# Altium schematic sheet Schem Motherboard.SchDoc
size A3; SheetNumber: 1; SheetTotal: 3
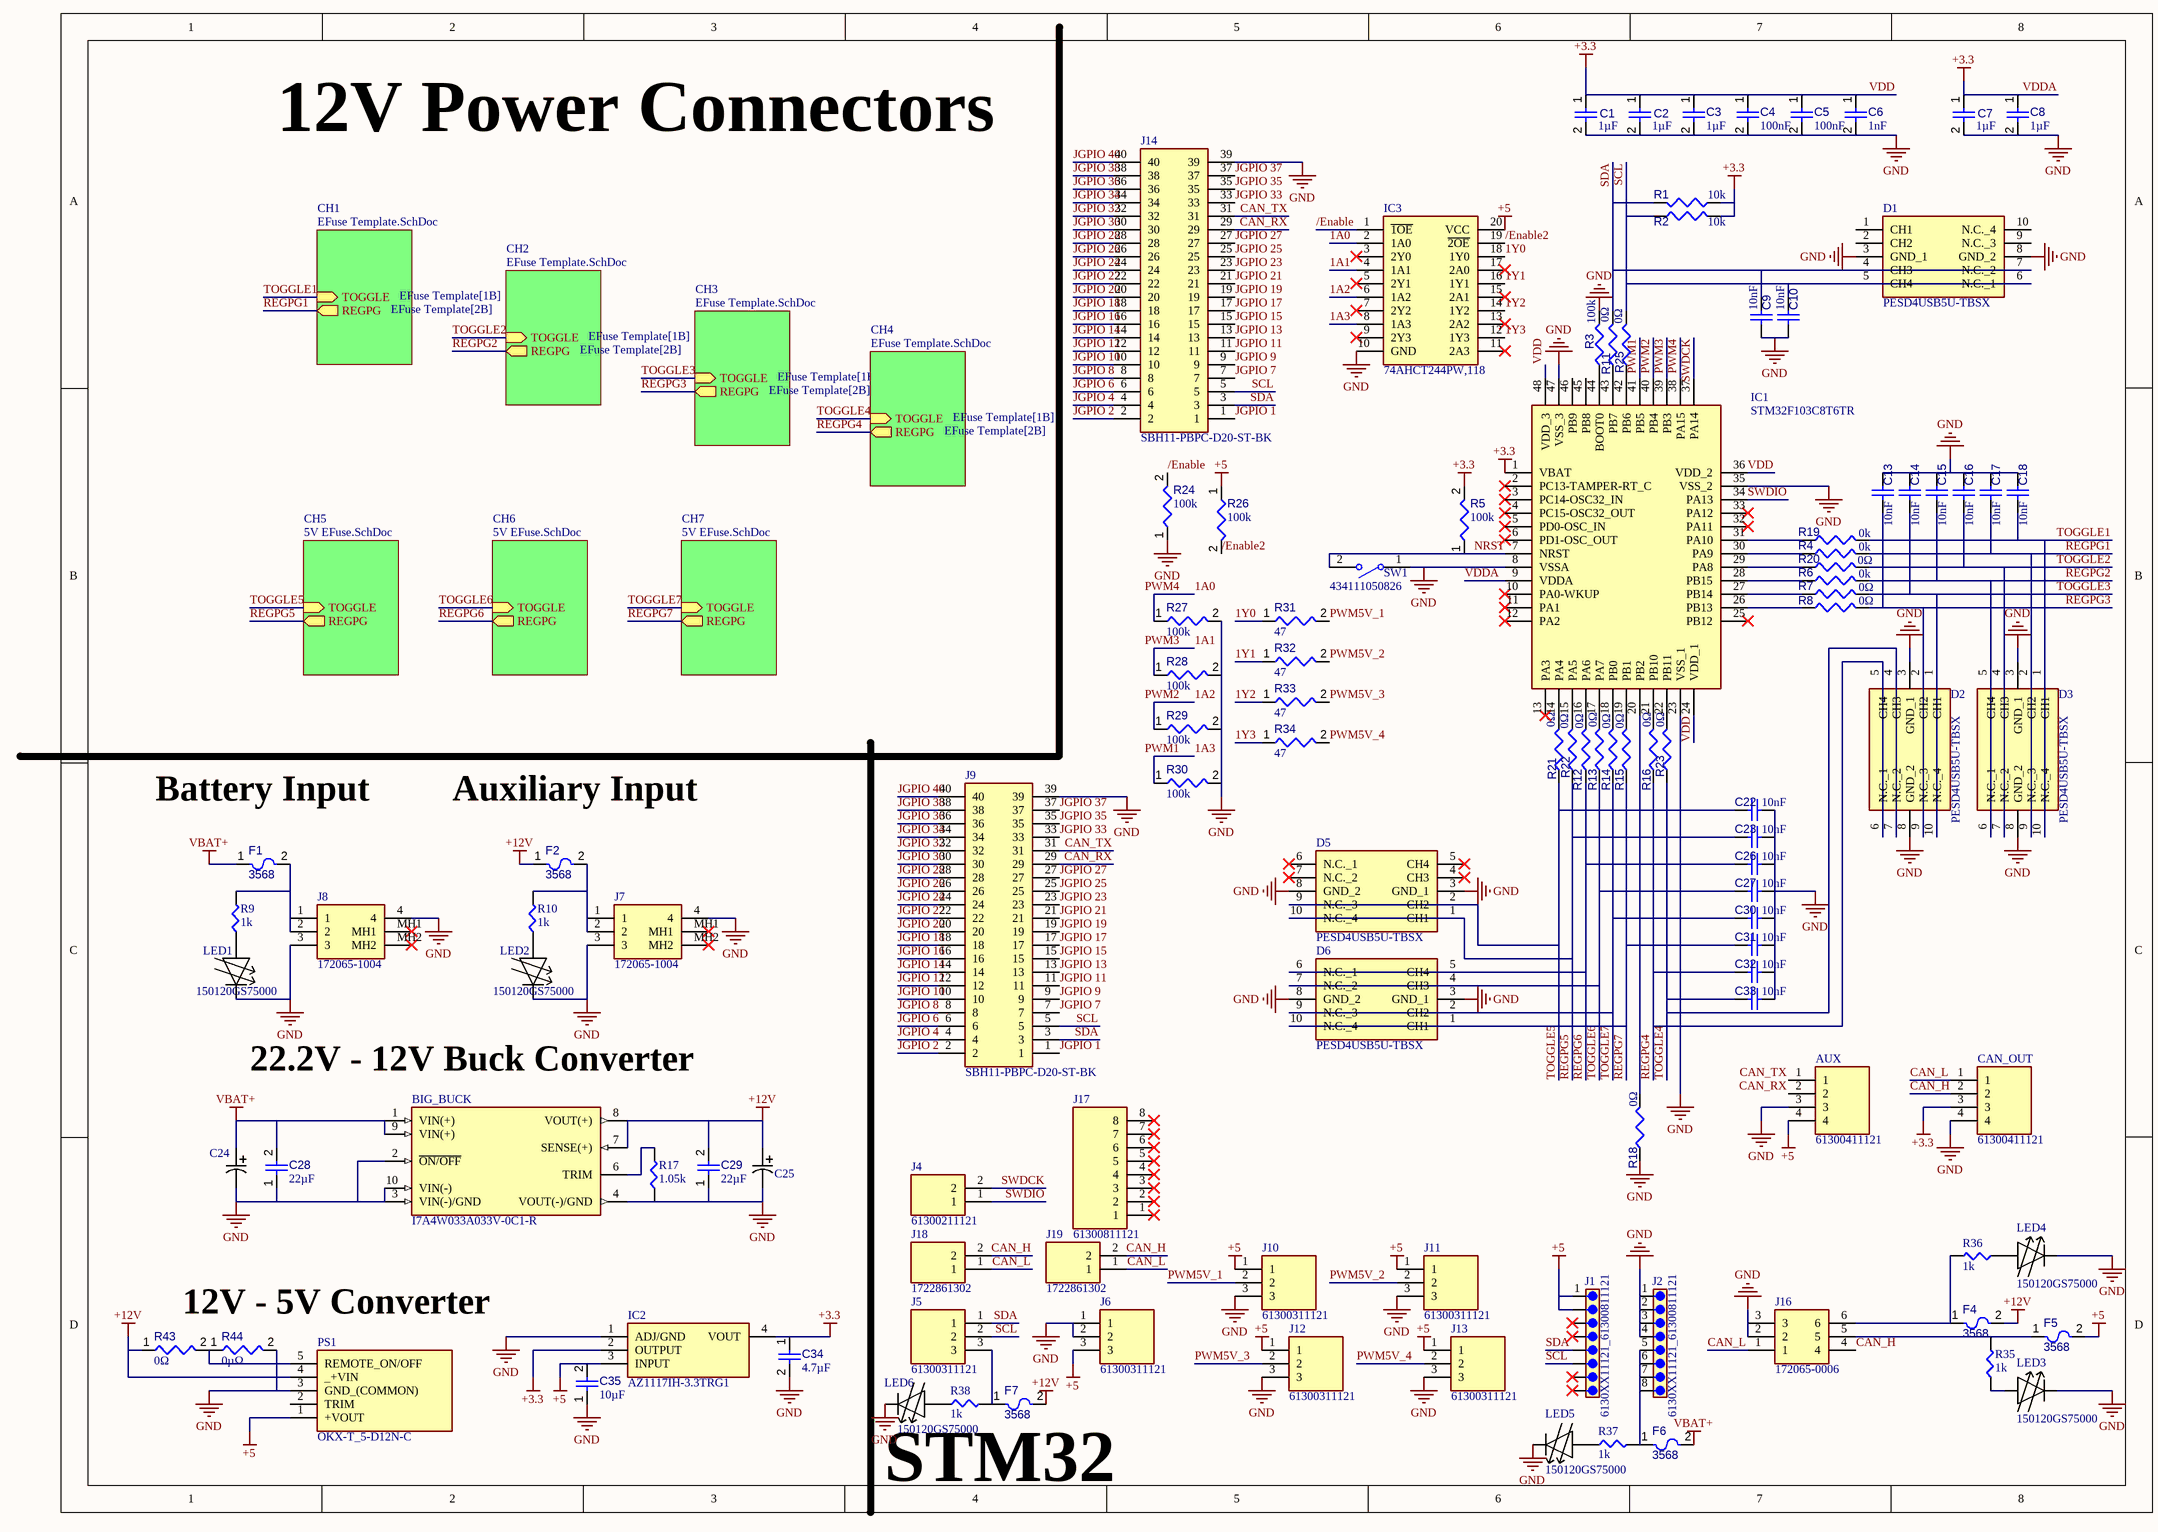
[diagram p0: Schem Motherboard.SchDoc]

## Parts
AUX  61300411121  [HDRV4W95P0X254_1X4_1016X254X854P]
BIG_BUCK  I7A4W033A033V-0C1-R  [CONV_I7A4W033A033V-0C1-R]
C1  value 1µF  [CAPC1608X94X35NL15T15]  (hidden comment: Capacitor 1 uF +/- 10% 16 V 0603)
C2  value 1µF  [CAPC1608X94X35NL15T15]  (hidden comment: Capacitor 1 uF +/- 10% 16 V 0603)
C3  value 1µF  [CAPC1608X94X35NL15T15]  (hidden comment: Capacitor 1 uF +/- 10% 16 V 0603)
C4  value 100nF  [CAPC1608X94X35NL15T15]  (hidden comment: Capacitor 1 uF +/- 10% 16 V 0603)
C5  value 100nF  [CAPC1608X94X35NL15T15]  (hidden comment: Capacitor 1 uF +/- 10% 16 V 0603)
C6  value 1nF  [CAPC1608X94X35NL15T15]  (hidden comment: Capacitor 1 uF +/- 10% 16 V 0603)
C7  value 1µF  [CAPC1608X94X35NL15T15]  (hidden comment: Capacitor 1 uF +/- 10% 16 V 0603)
C8  value 1µF  [CAPC1608X94X35NL15T15]  (hidden comment: Capacitor 1 uF +/- 10% 16 V 0603)
C9  value 10nF  [CAPC0402(1005)60_L]  (hidden comment: Capacitor 10nF +/-20% 50V 0402)
C10  value 10nF  [CAPC0402(1005)60_L]  (hidden comment: Capacitor 10nF +/-20% 50V 0402)
C13  value 10nF  [CAPC0402(1005)60_L]  (hidden comment: Capacitor 10nF +/-20% 50V 0402)
C14  value 10nF  [CAPC0402(1005)60_L]  (hidden comment: Capacitor 10nF +/-20% 50V 0402)
C15  value 10nF  [CAPC0402(1005)60_L]  (hidden comment: Capacitor 10nF +/-20% 50V 0402)
C16  value 10nF  [CAPC0402(1005)60_L]  (hidden comment: Capacitor 10nF +/-20% 50V 0402)
C17  value 10nF  [CAPC0402(1005)60_L]  (hidden comment: Capacitor 10nF +/-20% 50V 0402)
C18  value 10nF  [CAPC0402(1005)60_L]  (hidden comment: Capacitor 10nF +/-20% 50V 0402)
C22  value 10nF  [CAPC0402(1005)60_L]  (hidden comment: Capacitor 10nF +/-20% 50V 0402)
C23  value 10nF  [CAPC0402(1005)60_L]  (hidden comment: Capacitor 10nF +/-20% 50V 0402)
C24  UWT1E331MNL1GS  [PCAP_8x10-ELECT_NCA]  (value not drawn)
C25  UWT1E331MNL1GS  [PCAP_8x10-ELECT_NCA]  (value not drawn)
C26  value 10nF  [CAPC0402(1005)60_L]  (hidden comment: Capacitor 10nF +/-20% 50V 0402)
C27  value 10nF  [CAPC0402(1005)60_L]  (hidden comment: Capacitor 10nF +/-20% 50V 0402)
C28  value 22µF  [FP-GRM32E-0_3-0_2-IPC_C]  (hidden comment: GRM32ER71E226ME15K)
C29  value 22µF  [CAPC0805(2012)145_L]  (hidden comment: Capacitor 22µF +/-40% 16V 0805)
C30  value 10nF  [CAPC0402(1005)60_L]  (hidden comment: Capacitor 10nF +/-20% 50V 0402)
C31  value 10nF  [CAPC0402(1005)60_L]  (hidden comment: Capacitor 10nF +/-20% 50V 0402)
C32  value 10nF  [CAPC0402(1005)60_L]  (hidden comment: Capacitor 10nF +/-20% 50V 0402)
C33  value 10nF  [CAPC0402(1005)60_L]  (hidden comment: Capacitor 10nF +/-20% 50V 0402)
C34  value 4.7µF  [CAPC0805(2012)145_L]  (hidden comment: Capacitor 4.7µF +/-40% 25V 0805)
C35  value 10µF  [CAPC3216X180X50NL20T25]  (hidden comment: Capacitor 10 uF +/- 10% 16 V 1206)
CAN_OUT  61300411121  [HDRV4W95P0X254_1X4_1016X254X854P]
D1  PESD4USB5U-TBSX  [SON50P100X250X80-10N]
D2  PESD4USB5U-TBSX  [SON50P100X250X80-10N]
D3  PESD4USB5U-TBSX  [SON50P100X250X80-10N]
D5  PESD4USB5U-TBSX  [SON50P100X250X80-10N]
D6  PESD4USB5U-TBSX  [SON50P100X250X80-10N]
F1  3568  [KSTN-3568_V]
F2  3568  [KSTN-3568_V]
F4  3568  [KSTN-3568_V]
F5  3568  [KSTN-3568_V]
F6  3568  [KSTN-3568_V]
F7  3568  [KSTN-3568_V]
IC1  STM32F103C8T6TR  [QFP50P900X900X160-48N]
IC2  AZ1117IH-3.3TRG1  [SOT230P700X180-4N]
IC3  74AHCT244PW,118  [SOP65P640X110-20N]
J1  6130XX11121_61300811121  [61300811121]
J2  6130XX11121_61300811121  [61300811121]
J4  61300211121  [HDRV2W110P0X254_1X2_508X254X854P]
J5  61300311121  [HDRV3W64P0X254_1X3_762X254X869P]
J6  61300311121  [HDRV3W64P0X254_1X3_762X254X869P]
J7  172065-1004  [1720651004]
J8  172065-1004  [1720651004]
J9  SBH11-PBPC-D20-ST-BK  [SHDR40W64P254_2X20_5830X910X910P]
J10  61300311121  [HDRV3W64P0X254_1X3_762X254X869P]
J11  61300311121  [HDRV3W64P0X254_1X3_762X254X869P]
J12  61300311121  [HDRV3W64P0X254_1X3_762X254X869P]
J13  61300311121  [HDRV3W64P0X254_1X3_762X254X869P]
J14  SBH11-PBPC-D20-ST-BK  [SHDR40W64P254_2X20_5830X910X910P]
J16  172065-0006  [1720650006]
J17  61300811121  [HDRV8W64P0X254_1X8_2032X254X854P]
J18  1722861302  [1722861302]
J19  1722861302  [1722861302]
LED1  150120GS75000  [150120GS75000]
LED2  150120GS75000  [150120GS75000]
LED3  150120GS75000  [150120GS75000]
LED4  150120GS75000  [150120GS75000]
LED5  150120GS75000  [150120GS75000]
LED6  150120GS75000  [150120GS75000]
PS1  OKX-T_5-D12N-C  [OKXT5D12NC]
R1  value 10k  [RESC1608X55X25ML10T15]  (hidden comment: Resistor 100k +/-1% 0603 100 mW)
R2  value 10k  [RESC1608X55X25ML10T15]  (hidden comment: Resistor 100k +/-1% 0603 100 mW)
R3  value 100k  [RESC1608X55X25ML10T15]  (hidden comment: Resistor 100k +/-1% 0603 100 mW)
R4  value 0k  [RESC0402(1005)_L]  (hidden comment: RNCF0402TKY250R)
R5  value 100k  [RESC1608X55X25ML10T15]  (hidden comment: Resistor 100k +/-1% 0603 100 mW)
R6  value 0k  [RESC0402(1005)_L]  (hidden comment: RNCF0402TKY250R)
R7  value 0Ω  [RESC0402(1005)_L]  (hidden comment: RNCF0402TKY250R)
R8  value 0Ω  [RESC0402(1005)_L]  (hidden comment: RNCF0402TKY250R)
R9  value 1k  [SMD-1206-RES]  (hidden comment: ERJ-P08J102V)
R10  value 1k  [SMD-1206-RES]  (hidden comment: ERJ-P08J102V)
R11  value 0Ω  [RESC0402(1005)_L]  (hidden comment: RNCF0402TKY250R)
R12  value 0Ω  [RESC0402(1005)_L]  (hidden comment: RNCF0402TKY250R)
R13  value 0Ω  [RESC0402(1005)_L]  (hidden comment: RNCF0402TKY250R)
R14  value 0Ω  [RESC0402(1005)_L]  (hidden comment: RNCF0402TKY250R)
R15  value 0Ω  [RESC0402(1005)_L]  (hidden comment: RNCF0402TKY250R)
R16  value 0Ω  [RESC0402(1005)_L]  (hidden comment: RNCF0402TKY250R)
R17  value 1.05k  [SMD-1206-RES]  (hidden comment: ERJ-8ENF1051V)
R18  value 0Ω  [RESC0402(1005)_L]  (hidden comment: RNCF0402TKY250R)
R19  value 0k  [RESC0402(1005)_L]  (hidden comment: RNCF0402TKY250R)
R20  value 0Ω  [RESC0402(1005)_L]  (hidden comment: RNCF0402TKY250R)
R21  value 0Ω  [RESC0402(1005)_L]  (hidden comment: RNCF0402TKY250R)
R22  value 0Ω  [RESC0402(1005)_L]  (hidden comment: RNCF0402TKY250R)
R23  value 0Ω  [RESC0402(1005)_L]  (hidden comment: RNCF0402TKY250R)
R24  value 100k  [RESC1608X55X25ML10T15]  (hidden comment: Resistor 100k +/-1% 0603 100 mW)
R25  value 0Ω  [RESC0402(1005)_L]  (hidden comment: RNCF0402TKY250R)
R26  value 100k  [RESC1608X55X25ML10T15]  (hidden comment: Resistor 100k +/-1% 0603 100 mW)
R27  value 100k  [RESC1608X55X25ML10T15]  (hidden comment: Resistor 100k +/-1% 0603 100 mW)
R28  value 100k  [RESC1608X55X25ML10T15]  (hidden comment: Resistor 100k +/-1% 0603 100 mW)
R29  value 100k  [RESC1608X55X25ML10T15]  (hidden comment: Resistor 100k +/-1% 0603 100 mW)
R30  value 100k  [RESC1608X55X25ML10T15]  (hidden comment: Resistor 100k +/-1% 0603 100 mW)
R31  value 47  [RESC1608X55X25ML10T15]  (hidden comment: Resistor 100k +/-1% 0603 100 mW)
R32  value 47  [RESC1608X55X25ML10T15]  (hidden comment: Resistor 100k +/-1% 0603 100 mW)
R33  value 47  [RESC1608X55X25ML10T15]  (hidden comment: Resistor 100k +/-1% 0603 100 mW)
R34  value 47  [RESC1608X55X25ML10T15]  (hidden comment: Resistor 100k +/-1% 0603 100 mW)
R35  value 1k  [SMD-1206-RES]  (hidden comment: ERJ-P08J102V)
R36  value 1k  [SMD-1206-RES]  (hidden comment: ERJ-P08J102V)
R37  value 1k  [SMD-1206-RES]  (hidden comment: ERJ-P08J102V)
R38  value 1k  [SMD-1206-RES]  (hidden comment: ERJ-P08J102V)
R43  value 0Ω  [RESC0805(2012)_L]  (hidden comment: 1KR5J)
R44  value 0µΩ  [RESC0805(2012)_L]  (hidden comment: 1KR5J)
SW1  434111050826  [434111050826]

## Sub-sheets
CH1 = EFuse Template.SchDoc: TOGGLE (in), REGPG (out)  | SUPPLY: +12V
CH2 = EFuse Template.SchDoc: TOGGLE (in), REGPG (out)  | SUPPLY: +12V
CH3 = EFuse Template.SchDoc: TOGGLE (in), REGPG (out)  | SUPPLY: +12V
CH4 = EFuse Template.SchDoc: TOGGLE (in), REGPG (out)  | SUPPLY: +12V
CH5 = 5V EFuse.SchDoc: TOGGLE (in), REGPG (out)  | SUPPLY: +5
CH6 = 5V EFuse.SchDoc: TOGGLE (in), REGPG (out)  | SUPPLY: +5
CH7 = 5V EFuse.SchDoc: TOGGLE (in), REGPG (out)  | SUPPLY: +5

## Nets
+5: AUX.4 C35.2 F5.2 IC2.3(INPUT) IC3.20(VCC) J1.1 J1.2 J6.3 J10.1 J11.1 J12.1 J13.1 PS1.1(+VOUT) R26.1
+12V: BIG_BUCK.7(SENSE(+)) BIG_BUCK.8(VOUT(+)) C25.1 C29.2 F2.1 F4.2 F7.2 PS1.4(_+VIN) R43.1
GND: AUX.3 BIG_BUCK.2(~{ON/OFF}) BIG_BUCK.3(VIN(-)/GND) BIG_BUCK.4(VOUT(-)/GND) BIG_BUCK.10(VIN(-)) C1.2 C2.2 C3.2 C4.2 C5.2 C6.2 C7.2 C8.2 C9.2 C10.2 C13.1 C14.1 C15.1 C16.1 C17.1 C18.1 C22.1 C23.1 C24.2 C25.2 C26.1 C27.1 C28.1 C29.1 C30.1 C31.1 C32.1 C33.1 C34.2 C35.1 CAN_OUT.4 D1.3(GND_1) D1.8(GND_2) D2.3(GND_1) D2.8(GND_2) D3.3(GND_1) D3.8(GND_2) D5.3(GND_1) D5.8(GND_2) D6.3(GND_1) D6.8(GND_2) IC1.8(VSSA) IC1.23(VSS_1) IC1.35(VSS_2) IC1.47(VSS_3) IC2.1(ADJ/GND) IC3.10(GND) J2.1 J2.2 J2.3 J2.4 J6.1 J6.2 J7.3 J7.4 J8.3 J8.4 J9.39 J10.3 J11.3 J12.3 J13.3 J14.39 J16.2 J16.3 LED1.1 LED2.1 LED3.1 LED4.1 LED5.1 LED6.1 PS1.3(GND_(COMMON)) R3.2 R17.1 R18.1 R24.1 R27.2 R28.2 R29.2 R30.2 R44.2 SW1.1
VBAT+: BIG_BUCK.1(VIN(+)) BIG_BUCK.9(VIN(+)) C24.1 C28.2 F1.1 F6.2
VDD: C1.1 C2.1 C3.1 C4.1 C5.1 C6.1 C7.1 C8.1 C34.1 CAN_OUT.3 IC1.1(VBAT) IC1.9(VDDA) IC1.24(VDD_1) IC1.36(VDD_2) IC1.48(VDD_3) IC2.2(OUTPUT) IC2.4(VOUT) R1.1 R2.2 R5.2  [also labelled +3.3, VDDA]
1A0: IC1.38(PA15) IC3.2(1A0) R27.1  [also labelled PWM4]
1A1: IC1.39(PB3) IC3.4(1A1) R28.1  [also labelled PWM3]
1A2: IC1.40(PB4) IC3.6(1A2) R29.1  [also labelled PWM2]
1A3: IC1.41(PB5) IC3.8(1A3) R30.1  [also labelled PWM1]
1Y0: IC3.18(1Y0) R31.1
1Y1: IC3.16(1Y1) R32.1
1Y2: IC3.14(1Y2) R33.1
1Y3: IC3.12(1Y3) R34.1
/Enable: IC3.1(~{1OE}) R24.2
/Enable2: IC3.19(~{2OE}) R26.2
CAN_H: CAN_OUT.2 J16.4 J18.2 J19.2
CAN_L: CAN_OUT.1 J16.1 J18.1 J19.1
CAN_RX: AUX.2 J9.29 J14.29
CAN_TX: AUX.1 J9.31 J14.31
JGPIO 1: J9.1 J14.1
JGPIO 2: J9.2 J14.2
JGPIO 4: J9.4 J14.4
JGPIO 6: J9.6 J14.6
JGPIO 7: J9.7 J14.7
JGPIO 8: J9.8 J14.8
JGPIO 9: J9.9 J14.9
JGPIO 10: J9.10 J14.10
JGPIO 11: J9.11 J14.11
JGPIO 12: J9.12 J14.12
JGPIO 13: J9.13 J14.13
JGPIO 14: J9.14 J14.14
JGPIO 15: J9.15 J14.15
JGPIO 16: J9.16 J14.16
JGPIO 17: J9.17 J14.17
JGPIO 18: J9.18 J14.18
JGPIO 19: J9.19 J14.19
JGPIO 20: J9.20 J14.20
JGPIO 21: J9.21 J14.21
JGPIO 22: J9.22 J14.22
JGPIO 23: J9.23 J14.23
JGPIO 24: J9.24 J14.24
JGPIO 25: J9.25 J14.25
JGPIO 26: J9.26 J14.26
JGPIO 27: J9.27 J14.27
JGPIO 28: J9.28 J14.28
JGPIO 30: J9.30 J14.30
JGPIO 32: J9.32 J14.32
JGPIO 33: J9.33 J14.33
JGPIO 34: J9.34 J14.34
JGPIO 35: J9.35 J14.35
JGPIO 36: J9.36 J14.36
JGPIO 37: J9.37 J14.37
JGPIO 38: J9.38 J14.38
JGPIO 40: J9.40 J14.40
NRST: IC1.7(NRST) R5.1 SW1.2
PWM5V_1: J10.2 R31.2
PWM5V_2: J11.2 R32.2
PWM5V_3: J12.2 R33.2
PWM5V_4: J13.2 R34.2
REGPG1: C17.2 D3.2(CH2) D3.9(N.C._3) R4.2 ; sheet CH1/REGPG
REGPG2: C15.2 D3.5(CH4) D3.6(N.C._1) R6.2 ; sheet CH2/REGPG
REGPG3: C13.2 D2.2(CH2) D2.9(N.C._3) R8.2 ; sheet CH3/REGPG
REGPG4: C32.2 D2.5(CH4) D2.6(N.C._1) R16.1 ; sheet CH4/REGPG
REGPG5: C23.2 D5.1(CH1) D5.10(N.C._4) R22.1 ; sheet CH5/REGPG
REGPG6: C26.2 D6.5(CH4) D6.6(N.C._1) R12.1 ; sheet CH6/REGPG
REGPG7: C31.2 D6.1(CH1) D6.10(N.C._4) R15.1 ; sheet CH7/REGPG
SCL: C10.1 D1.5(CH4) D1.6(N.C._1) J1.6 J5.2 J9.5 J14.5 R2.1 R25.2
SDA: C9.1 D1.4(CH3) D1.7(N.C._2) J1.5 J5.1 J9.3 J14.3 R1.2 R11.2
SWDCK: IC1.37(PA14) J4.2
SWDIO: IC1.34(PA13) J4.1
TOGGLE1: C18.2 D3.1(CH1) D3.10(N.C._4) R19.2 ; sheet CH1/TOGGLE
TOGGLE2: C16.2 D3.4(CH3) D3.7(N.C._2) R20.2 ; sheet CH2/TOGGLE
TOGGLE3: C14.2 D2.1(CH1) D2.10(N.C._4) R7.2 ; sheet CH3/TOGGLE
TOGGLE4: C33.2 D2.4(CH3) D2.7(N.C._2) R23.1 ; sheet CH4/TOGGLE
TOGGLE5: C22.2 D5.2(CH2) D5.9(N.C._3) R21.1 ; sheet CH5/TOGGLE
TOGGLE6: C27.2 D6.4(CH3) D6.7(N.C._2) R13.1 ; sheet CH6/TOGGLE
TOGGLE7: C30.2 D6.2(CH2) D6.9(N.C._3) R14.1 ; sheet CH7/TOGGLE
NetBIG_BUCK_6: BIG_BUCK.6(TRIM) R17.2
NetF1_2: F1.2 J8.1 J8.2 R9.2
NetF2_2: F2.2 J7.1 J7.2 R10.2
NetF4_1: F4.1 J16.6 R36.2
NetF5_1: F5.1 J16.5 R35.2
NetF6_1: F6.1 J2.5 J2.6 J2.7 J2.8 R37.2
NetF7_1: F7.1 J5.3 R38.2
NetIC1_14: IC1.14(PA4) R21.2
NetIC1_15: IC1.15(PA5) R22.2
NetIC1_16: IC1.16(PA6) R12.2
NetIC1_17: IC1.17(PA7) R13.2
NetIC1_18: IC1.18(PB0) R14.2
NetIC1_19: IC1.19(PB1) R15.2
NetIC1_20: IC1.20(PB2) R18.2
NetIC1_21: IC1.21(PB10) R16.2
NetIC1_22: IC1.22(PB11) R23.2
NetIC1_26: IC1.26(PB13) R8.1
NetIC1_27: IC1.27(PB14) R7.1
NetIC1_28: IC1.28(PB15) R6.1
NetIC1_29: IC1.29(PA8) R20.1
NetIC1_30: IC1.30(PA9) R4.1
NetIC1_31: IC1.31(PA10) R19.1
NetIC1_42: IC1.42(PB6) R25.1
NetIC1_43: IC1.43(PB7) R11.1
NetIC1_44: IC1.44(BOOT0) R3.1
NetLED1_2: LED1.2 R9.1
NetLED2_2: LED2.2 R10.1
NetLED3_2: LED3.2 R35.1
NetLED4_2: LED4.2 R36.1
NetLED5_2: LED5.2 R37.1
NetLED6_2: LED6.2 R38.1
NetPS1_5: PS1.5(REMOTE_ON/OFF) R43.2 R44.1

Not connected (* = marked no-connect by the designer): D1 1(CH1) 2(CH2) 9(N.C._3) 10(N.C._4); D5 4(CH3)* 5(CH4)* 6(N.C._1)* 7(N.C._2)*; IC1 2(PC13-TAMPER-RT_C)* 3(PC14-OSC32_IN)* 4(PC15-OSC32_OUT)* 5(PD0-OSC_IN)* 6(PD1-OSC_OUT)* 10(PA0-WKUP)* 11(PA1)* 12(PA2)* 13(PA3)* 25(PB12)* 32(PA11)* 33(PA12)* 45(PB8) 46(PB9); IC3 3(2Y0)* 5(2Y1)* 7(2Y2)* 9(2Y3)* 11(2A3)* 13(2A2)* 15(2A1)* 17(2A0)*; J1 3* 4* 7* 8*; J7 MH1* MH2*; J8 MH1* MH2*; J17 1* 2* 3* 4* 5* 6* 7* 8*; PS1 2(TRIM)

## Notes on the sheet
- 12V Power Connectors
- Battery Input
- Auxiliary Input
- 22.2V - 12V Buck Converter
- 12V - 5V Converter
- STM32

## Library data of the parts
AUX CAN_OUT = 61300411121: Connector; Manufacturer_Name: Wurth Elektronik; Datasheet Link: https://www.we-online.com/components/products/download/3D_61300411121+%28rev1%29.pdf; Height: 8.54mm; Manufacturer_Part_Number: 61300411121; Mouser Part Number: 710-61300411121; Mouser Price/Stock: https://www.mouser.co.uk/ProductDetail/Wurth-Elektronik/61300411121?qs=PhR8RmCirEYQcLLqXD8rAA%3D%3D
BIG_BUCK = CMP-096-000000-2: Non-Isolated PoL Module DC DC Converter 1 Output 3.3V ~ 24V - - - 33A 18V - 60V Input; MF: TDK-Lambda Americas Inc; Price: None; Availability: In Stock; Purchase-URL: https://pricing.snapeda.com/search/part/I7A4W033A033V-0C1-R/?ref=eda; Component Type: Standard; Value: *; Package: None; Design Item ID: I7A4W033A033V-0C1-R; MP: I7A4W033A033V-0C1-R; Pin Count: 7; SnapEDA_Link: https://www.snapeda.com/parts/I7A4W033A033V-0C1-R/TDK-Lambda+Americas+Inc/view-part/?ref=snap; Source: I7A4W033A033V-0C1-R.SchLib; Check_prices: https://www.snapeda.com/parts/I7A4W033A033V-0C1-R/TDK-Lambda+Americas+Inc/view-part/?ref=eda
C1-C8 = CMP-001-00003-6: Chip Capacitor, 1 uF, +/- 10%, 16 V, 0603 (1608 Metric); Voltage Rating: 16V; Capacitor Type: Ceramic; Max Operating Temperature: 125°C; Pins: 2; Tolerance: 10%; Min Operating Temperature: -55°C; RoHS Compliant: True; Mounting Technology: SM; Case/Package: 0603
C9 C10 C13-C18 C22 C23 C26 C27 C30-C33 = CMP-001-00069-3: Chip Capacitor, 10nF +/-20%, 50V, 0402, Thickness 0.6 mm; Tolerance: 5%; Max Operating Temperature: 85°C; Pins: 2; Case/Package: 0402; Voltage Rating: 50V; Min Operating Temperature: -55°C; Mounting Technology: SMT
C24 C25 = CMP-001-00085-2: Aluminum Electrolytic Capacitor, Polarized, Aluminum (wet), 25V, 20% +Tol, 20% -Tol, 330uF, Surface Mount, 3333; Mfr_Name: Nichicon; Type: DEV; Manufacturer_Part_Number: UWT1E331MNL1GS; Source: UWT1E331MNL1GS.SchLib; Design Item ID: UWT1E331MNL1GS; RefDes: RefDes; Copyright: Copyright (C) 2024 Ultra Librarian. All rights reserved.
C28 = CMP-001-00084-1: Ceramic Capacitor, Multilayer, Ceramic, 25V, 20% +Tol, 20% -Tol, X7R, 15% TC, 22uF, Surface Mount, 1210; Min Operating Temperature: -55°C; Pins: 2; Max Operating Temperature: 125°C; Mounting Technology: Surface Mount; Capacitor Type: Ceramic; Case/Package: 1210; RoHS Compliant: Yes
C29 = CMP-001-00081-4: Chip Capacitor, 22µF +/-40%, 16V, 0805, Thickness 1.45 mm; Tolerance: 5%; Voltage Rating: 16V; Mounting Technology: SMT; Pins: 2; Max Operating Temperature: 85°C; Case/Package: 0805; Min Operating Temperature: -55°C
C34 = CMP-001-00080-4: Chip Capacitor, 4.7µF +/-40%, 25V, 0805, Thickness 1.45 mm; Tolerance: 20%; Voltage Rating: 25V; Min Operating Temperature: -55°C; Max Operating Temperature: 85°C; Pins: 2; Mounting Technology: SMT; Case/Package: 0805
C35 = CMP-001-00016-6: Chip Capacitor, 10 uF, +/- 10%, 16 V, 1206 (3216 Metric); Capacitor Type: Ceramic; Voltage Rating: 16V; Tolerance: 10%; Min Operating Temperature: -55°C; Pins: 2; Mounting Technology: SM; Case/Package: 1206; Max Operating Temperature: 125°C; RoHS Compliant: True
D1-D3 D5 D6 = PESD4USB5U-TBSX: Diode; Manufacturer_Name: Nexperia; Datasheet Link: https://assets.nexperia.com/documents/data-sheet/PESD4USB5U-TBS.pdf; Height: 0.8mm; Manufacturer_Part_Number: PESD4USB5U-TBSX; Mouser Part Number: 771-PESD4USB5U-TBSX; Mouser Price/Stock: https://www.mouser.co.uk/ProductDetail/Nexperia/PESD4USB5U-TBSX?qs=ljCeji4nMDmlBRiGiyUt1A%3D%3D
F1 F2 F4-F7 = CMP-005-00013-2: Fuses/Accessories
IC1 = STM32F103C8T6TR: Integrated Circuit; Manufacturer_Name: STMicroelectronics; Datasheet Link: http://media.digikey.com/pdf/Data%20Sheets/ST%20Microelectronics%20PDFS/STM32F103x8,B.pdf; Height: 1.6mm; Manufacturer_Part_Number: STM32F103C8T6TR; Mouser Part Number: 511-STM32F103C8T6TR; Mouser Price/Stock: https://www.mouser.co.uk/ProductDetail/STMicroelectronics/STM32F103C8T6TR?qs=5HwTSiuA5HDxFj62n06yag%3D%3D; Arrow Part Number: STM32F103C8T6TR; Arrow Price/Stock: https://www.arrow.com/en/products/stm32f103c8t6tr/stmicroelectronics?utm_currency=USD&region=nac
IC2 = AZ1117IH-3.3TRG1: Integrated Circuit; Manufacturer_Name: Diodes Incorporated; Datasheet Link: https://www.diodes.com//assets/Datasheets/AZ1117I.pdf; Height: 1.8mm; Manufacturer_Part_Number: AZ1117IH-3.3TRG1; Mouser Part Number: 621-AZ1117IH-3.3TRG1; Mouser Price/Stock: https://www.mouser.co.uk/ProductDetail/Diodes-Incorporated/AZ1117IH-3.3TRG1?qs=cpo3%2FpBou2jnS4SxLgAVoA%3D%3D; Arrow Part Number: AZ1117IH-3.3TRG1; Arrow Price/Stock: https://www.arrow.com/en/products/az1117ih-3.3trg1/diodes-incorporated?utm_currency=USD&region=europe
IC3 = 74AHCT244PW,118: Integrated Circuit; Manufacturer_Name: Nexperia; Datasheet Link: https://assets.nexperia.com/documents/data-sheet/74AHC_AHCT244.pdf; Height: 1.1mm; Manufacturer_Part_Number: 74AHCT244PW,118; Mouser Part Number: 771-AHCT244PW118; Mouser Price/Stock: https://www.mouser.co.uk/ProductDetail/Nexperia/74AHCT244PW118?qs=P62ublwmbi%252BwpHKVMKyyhA%3D%3D; Arrow Part Number: 74AHCT244PW,118; Arrow Price/Stock: https://www.arrow.com/en/products/74ahct244pw118/nexperia?region=nac
J1 J2 = 6130XX11121_61300811121: MF: {'manufacturer': u'Wurth Electronics'}; Package: None; Price: None; Value: *; MP: 61300811121; Availability: Unavailable
J4 = 61300211121: Connector; Manufacturer_Name: Wurth Elektronik; Datasheet Link: https://componentsearchengine.com/Datasheets/2/61300211121.pdf; Height: 8.54mm; Manufacturer_Part_Number: 61300211121; Mouser Part Number: 710-61300211121; Mouser Price/Stock: https://www.mouser.co.uk/ProductDetail/Wurth-Elektronik/61300211121?qs=t4813l51qx%252B1A5GYDQxPlw%3D%3D
J5 J6 = 61300311121: Connector; Manufacturer_Name: Wurth Elektronik; Datasheet Link: https://www.we-online.com/components/products/download/3D_61300311121+%28rev1%29.pdf; Height: 8.69mm; Manufacturer_Part_Number: 61300311121; Mouser Part Number: 710-61300311121; Mouser Price/Stock: https://www.mouser.co.uk/ProductDetail/Wurth-Elektronik/61300311121?qs=PhR8RmCirEYxRWFJzNKsUw%3D%3D
J7 J8 = 172065-1004: Connector; Manufacturer_Name: Molex; Datasheet Link: https://www.molex.com/pdm_docs/sd/1720651004_sd.pdf; Height: 15.05mm; Manufacturer_Part_Number: 172065-1004; Mouser Part Number: 538-172065-1004; Mouser Price/Stock: https://www.mouser.co.uk/ProductDetail/Molex/172065-1004?qs=KpdAywxU010EsUeYPQH2TA%3D%3D
J9 J14 = SBH11-PBPC-D20-ST-BK: Connector; Manufacturer_Name: Sullins; Datasheet Link: https://drawings-pdf.s3.amazonaws.com/11091.pdf; Height: 9.1mm; Manufacturer_Part_Number: SBH11-PBPC-D20-ST-BK
J10-J13 = CMP-002-00097-1: WR-PHD 2.54 mm Pin Header 3 pins; Manufacturer_Name: Wurth Elektronik; Design Item ID: 61300311121; Height: 8.69mm; Datasheet Link: https://www.we-online.com/components/products/download/3D_61300311121+%28rev1%29.pdf; Manufacturer_Part_Number: 61300311121; Source: SamacSys.SchLib; Mouser Part Number: 710-61300311121; Mouser Price/Stock: https://www.mouser.co.uk/ProductDetail/Wurth-Elektronik/61300311121?qs=PhR8RmCirEYxRWFJzNKsUw%3D%3D
J16 = 172065-0006: Connector; Manufacturer_Name: Molex; Datasheet Link: http://www.molex.com/pdm_docs/sd/1720650006_sd.pdf; Height: 15.05mm; Manufacturer_Part_Number: 172065-0006; Mouser Part Number: 538-172065-0006; Mouser Price/Stock: https://www.mouser.co.uk/ProductDetail/Molex/172065-0006?qs=MxnWX8BLHKddkNQQVyFzhA%3D%3D
J17 = 61300811121: Connector; Manufacturer_Name: Wurth Elektronik; Datasheet Link: http://katalog.we-online.de/em/datasheet/6130xx11121.pdf; Height: 8.54mm; Manufacturer_Part_Number: 61300811121; Mouser Part Number: 710-61300811121; Mouser Price/Stock: https://www.mouser.co.uk/ProductDetail/Wurth-Elektronik/61300811121?qs=PhR8RmCirEZRdx%252BVlEmRRA%3D%3D
J18 J19 = 1722861302: Connector; Manufacturer_Name: Molex; Datasheet Link: https://www.molex.com/en-us/products/part-detail-pdf/1722861302?display=pdf; Height: 14.5mm; Manufacturer_Part_Number: 1722861302; Arrow Part Number: 1722861302; Arrow Price/Stock: https://www.arrow.com/en/products/172286-1302/molex
LED1-LED6 = CMP-036-000001-1: Green Status LED 1206; Source: LED - Chip.SchLib; Design Item ID: 150120GS75000; ComponentLink1Description: Schematic; ComponentLink1URL: https://katalog.we-online.de/led/datasheet/150120GS75000.pdf
PS1 = OKX-T_5-D12N-C: Power Supply; Manufacturer_Name: Murata Electronics; Manufacturer_Part_Number: OKX-T/5-D12N-C; Datasheet Link: https://www.murata.com/products/productdata/8807038779422/okx-t5-d12.pdf; Height: 10.7mm; Mouser Part Number: 580-OKX-T/5-D12N-C; Mouser Price/Stock: https://www.mouser.co.uk/ProductDetail/Murata-Power-Solutions/OKX-T-5-D12N-C?qs=02kMkzikyGLvm54CNm6L0g%3D%3D; Arrow Part Number: OKX-T/5-D12N-C; Arrow Price/Stock: https://www.arrow.com/en/products/okx-t5-d12n-c/murata-power-solutions?utm_currency=USD&region=nac
R1-R3 R5 R24 R26-R34 = CMP-009-00023-5: Chip Resistor, 100 KOhm, +/- 1%, 0.1 W, -55 to 155 degC, 0603 (1608 Metric); Voltage Rating: 50V; Power: 100mW; Max Operating Temperature: 155°C; RoHS Compliant: True; Tolerance: 1%; Pins: 2; Case/Package: 0603; Mounting Technology: SM; Min Operating Temperature: -55°C
R4 R6-R8 R11-R16 R18-R23 R25 = CMP-009-00075-2: 1K 0.063W 5% 0402 (1005 Metric)  SMD; Power: 63mW; Pins: 2; Mounting Technology: SMT; Case/Package: 0402; Tolerance: 5%
R9 R10 R35-R38 = CMP-053-001023-1: RES SMD 1K OHM 5% 2/3W 1206; Manufacturer: Panasonic Electronic Components; Power (Watts): 0.667W, 2/3W; Temperature Coefficient: ±200ppm/°C; Factory Stock: 0; Unit Price (USD): 0.02178; @ qty: 1500; Minimum Quantity: 1; Digi-Key Part Number: P1.0KALCT-ND; Package / Case: 1206 (3216 Metric); Datasheets: https://industrial.panasonic.com/cdbs/www-data/pdf/RDA0000/AOA0000C243.pdf; Part Number: ERJ-P08J102V; Packaging: Cut Tape (CT); Height - Seated (Max): 0.028" (0.70mm); Number of Terminations: 2; Image: //media.digikey.com/Renders/Panasonic%20Renders/ERJ-1206%20Pkg.jpg; Source: Panasonic_ERJ_1206.SchLib; Quantity Available: 85126; Features: Automotive AEC-Q200, Pulse Withstanding; Design Item ID: ERJ-P08J102V; Tolerance: ±5%; Supplier Device Package: 1206; Part Status: Active; Failure Rate: -; Size / Dimension: 0.126" L x 0.063" W (3.20mm x 1.60mm); Series: ERJ; Operating Temperature: -55°C ~ 155°C; Pin Count: 2; Component Type: Standard; Composition: Thick Film
R17 = CMP-053-000194-1: RES SMD 1.05K OHM 1% 1/4W 1206; Manufacturer: Panasonic Electronic Components; Unit Price (USD): 0.00933; Minimum Quantity: 1; Power (Watts): 0.25W, 1/4W; Temperature Coefficient: ±100ppm/°C; @ qty: 1500; Factory Stock: 0; Height - Seated (Max): 0.028" (0.70mm); Pin Count: 2; Source: Panasonic_ERJ_1206.SchLib; Tolerance: ±1%; Series: ERJ; Failure Rate: -; Number of Terminations: 2; Composition: Thick Film; Component Type: Standard; Operating Temperature: -55°C ~ 155°C; Datasheets: http://industrial.panasonic.com/www-cgi/jvcr13pz.cgi?E+PZ+3+AOA0002+ERJ8ENF1051V+7+WW; Packaging: Cut Tape (CT); Image: //media.digikey.com/Renders/Panasonic%20Renders/ERJ-1206%20Pkg.jpg; Part Status: Active; Size / Dimension: 0.126" L x 0.063" W (3.20mm x 1.60mm); Design Item ID: ERJ-8ENF1051V; Quantity Available: 34990; Supplier Device Package: 1206; Digi-Key Part Number: P1.05KFCT-ND; Features: Automotive AEC-Q200; Part Number: ERJ-8ENF1051V; Package / Case: 1206 (3216 Metric)
R43 R44 = CMP-009-00076-2: 1K 0.125W 5% 0805 (2012 Metric)  SMD; Power: 125mW; Pins: 2; Mounting Technology: SMT; Tolerance: 5%; Case/Package: 0805
SW1 = CMP-011-00014-1: Keypad Switch, 1 Switches, SPST, Momentary-tactile, 0.05A, 12VDC, 3.24N, Solder Terminal, Surface Mount-straight; Min Operating Temperature: -40°C; Mounting Technology: Surface Mount; RoHS Compliant: Yes; Max Operating Temperature: 85°C